# Altium schematic sheet Main.SchDoc
size A3; Organization: CZ-GZZ; Address1: PO BOX 37; Address2: Mt Colah; Address3: NSW; Address4: Australia 2079; SheetNumber: 1; SheetTotal: 1
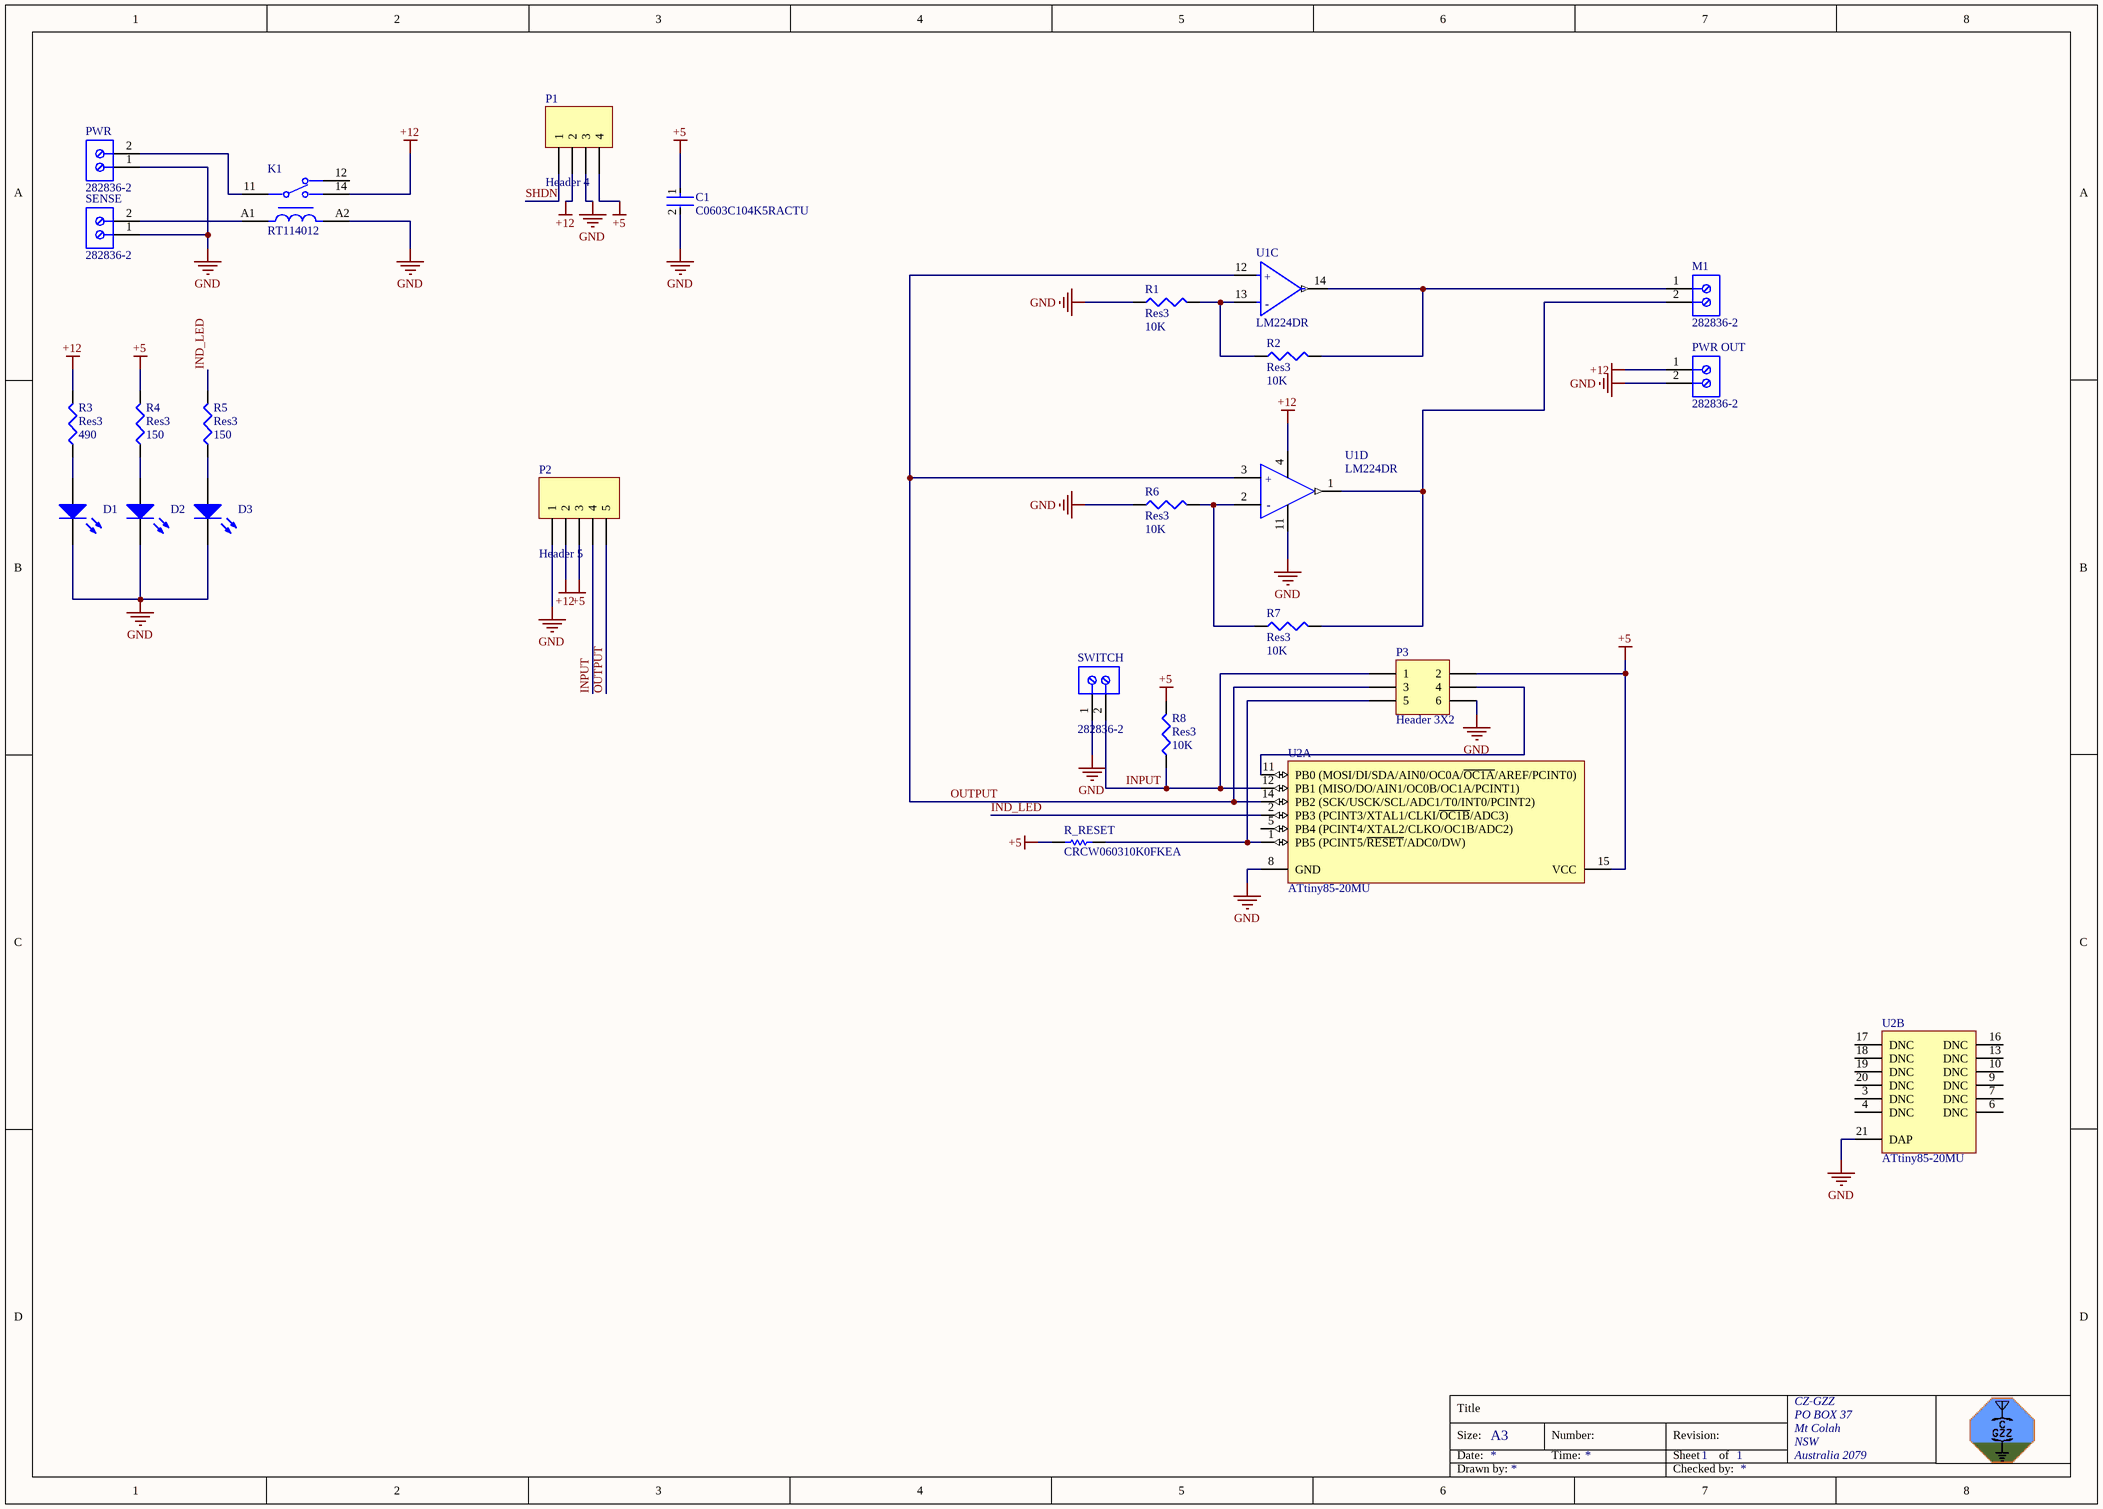
[diagram p0: Main.SchDoc]

## Parts
C1  C0603C104K5RACTU  [FP-C0603C-CF-MFG]
D1  LED2  [3.2X1.6X1.1]  (value not drawn)
D2  LED2  [3.2X1.6X1.1]  (value not drawn)
D3  LED2  [3.2X1.6X1.1]  (value not drawn)
K1  RT114012  [FP-RT114012-MFG]
M1  282836-2  [TECO-282836-2_V]
P1  Header 4  [HDR1X4]
P2  Header 5  [HDR1X5]
P3  Header 3X2  [HDR2X3]
PWR  282836-2  [TECO-282836-2_V]
PWR_OUT  282836-2  [TECO-282836-2_V]
R1  Res3  value 10K  [J1-0603]
R2  Res3  value 10K  [J1-0603]
R3  Res3  value 490  [J1-0603]
R4  Res3  value 150  [J1-0603]
R5  Res3  value 150  [J1-0603]
R6  Res3  value 10K  [J1-0603]
R7  Res3  value 10K  [J1-0603]
R8  Res3  value 10K  [J1-0603]
R_RESET  CRCW060310K0FKEA  [RESC1609X50X30NL8T20]
SENSE  282836-2  [TECO-282836-2_V]
SWITCH  282836-2  [TECO-282836-2_V]
U1  LM224DR  [FP-D0014A-IPC_C]  (parts C,D of 4)
U2  ATtiny85-20MU  [20M1_N]  (parts A,B of 2)

## Nets
+5: C1.1 P1.4 P2.3 P3.2 R4.2 R8.2 R_RESET.2 U2.15(VCC)
+12: K1.14 P1.2 P2.2 PWR_OUT.1 R3.2 U1.4(VCC)
GND: C1.2 D1.2(K) D2.2(K) D3.2(K) K1.A2 P1.3 P2.1 P3.6 PWR.1 PWR_OUT.2 R1.1 R6.1 SENSE.1 SWITCH.1 U1.11(GND) U2.8(GND) U2.21(DAP)
IND_LED: R5.2 U2.2(PB3_(PCINT3/XTAL1/CLKI/~{OC1B}/ADC3))
INPUT: P2.4 P3.1 R8.1 SWITCH.2 U2.12(PB1_(MISO/DO/AIN1/OC0B/OC1A/PCINT1))
OUTPUT: P2.5 P3.3 U1.3(1IN+) U1.12(4IN+) U2.14(PB2_(SCK/USCK/SCL/ADC1/T0/INT0/PCINT2))
SHDN: P1.1
NetD1_1: D1.1(A) R3.1
NetD2_1: D2.1(A) R4.1
NetD3_1: D3.1(A) R5.1
NetK1_11: K1.11 PWR.2
NetK1_A1: K1.A1 SENSE.2
NetM1_1: M1.1 R2.2 U1.14(4OUT)
NetM1_2: M1.2 R7.2 U1.1(1OUT)
NetP3_4: P3.4 U2.11(PB0_(MOSI/DI/SDA/AIN0/OC0A/~{OC1A}/AREF/PCINT0))
NetP3_5: P3.5 R_RESET.1 U2.1(PB5_(PCINT5/~{RESET}/ADC0/DW))
NetR1_2: R1.2 R2.1 U1.13(4IN-)
NetR6_2: R6.2 R7.1 U1.2(1IN-)

Not connected (* = marked no-connect by the designer): K1 12; U2 3(DNC) 4(DNC) 5(PB4_(PCINT4/XTAL2/CLKO/OC1B/ADC2)) 6(DNC) 7(DNC) 9(DNC) 10(DNC) 13(DNC) 16(DNC) 17(DNC) 18(DNC) 19(DNC) 20(DNC)

## Notes on the sheet
- Title
- Size:
- Date:
- A3
- Number:
- Time:
- Revision:
- Sheet
- of
- Drawn by:
- Checked by:
- (in symbol CMP-04895-000142-1, part C) +
- (in symbol CMP-04895-000142-1, part D) +

## Library data of the parts
C1 = CMP-2006-03061-2: CAP CER 0.1UF 50V X7R 0603; Manufacturer: KEMET; Tolerance: 0.1; Temperature Coefficient: 30ppm/°C; Material: Ceramic; Automotive Grade: Grade 1; Value: 0.10 μF; Temperature: -55°C to +125°C; RoHS: TRUE; Temperature Range High: +125°C; Lead Free: Yes; Octopart: https://octopart.com/c0603c104k5ractu-kemet-139244; Digikey Description: CAP CER 0.1UF 50V X7R 0603; Category: Cap; Package: C0603C-CF; ComponentLink2Description: Datasheet; Temperature Range Low: -55°C; Device Class L1: Passive Components; Voltage Rating: 50 V; Automotive: Yes; Device Class L3: Ceramic Capacitors; ComponentLink2URL: https://api.kemet.com/component-edge/download/datasheet/C0603C100J5GACAUTO.pdf; Capacitance: 0.10 μF; Device Class L2: Capacitors; Manufacturer Part Number: C0603C104K5RACTU; Temperature Characteristic: X7R; Height: 0.87mm
D1-D3 = LED2: Typical RED, GREEN, YELLOW, AMBER GaAs LED; Published: 8-Jun-2000; LatestRevisionDate: 17-Jul-2002; LatestRevisionNote: Re-released for DXP Platform.; PackageVersion: Feb-2002; PackageReference: 3.2X1.6X1.1; Publisher: Altium Limited; PackageDescription: SM LED; 2 Flat Leads
K1 = CMP-03395-000068-1: RELAY GEN PURPOSE SPDT 12A 12V; Manufacturer: TE Connectivity; Coil Power: 400mW; Coil Resistance: 360Ω; Coil Type: Non-Latching; Number Of Contacts: 1; Height: 15.7mm; Throw Configuration: SPDT; Mouser Description: General Purpose Relays RT114012; Device Class L1: Electromechanical; ComponentLink2URL: https://www.te.com/commerce/DocumentDelivery/DDEController?Action=showdoc&DocId=Data+Sheet%7FRT1%7F0219%7Fpdf%7FEnglish%7FENG_DS_RT1_0219.pdf%7F1419108-1; Digikey Description: RELAY GEN PURPOSE SPDT 12A 12V; Package: RT114012; RoHS: TRUE; ComponentLink2Description: Datasheet; Octopart: https://octopart.com/rt114012-te+connectivity-39636422; Device Class L2: Relays; Manufacturer Part Number: RT114012; Ambient Temperature Range High: +85°C; Ambient Temperature Range Low: -40°C; Coil Voltage: 12V; Current Rating: 12A; Category: Relay; Lead Free: Yes; Device Class L3: Power Relays; Automotive: No
M1 PWR PWR_OUT SENSE SWITCH = CMP-1684-00017-1: Female Header, Pitch 5 mm, 1 x 2 Position, Height 10 mm, Tail Length 3.5 mm, Rohs, Bulk; Manufacturer: TE Connectivity; Wire Gauge: 16-30AWG; Product Training Modules: Wire-to-BoardEurostyleTerminalBlocks; Clamp Material - Plating: Brass-NickelPlated; Voltage: 300V; Mating Orientation: HorizontalwithBoard; Current: 13.5A; Pitch: 0.197"(5.00mm); Screw Thread: M3; 3D Model: 282836-2.pdf; Other Names: 5ULV-02B / A98076; Dynamic Catalog: BuchananSeries; Number of Levels: 1; Torque - Screw: 0.68Nm(6Lb-In); Featured Product: EurostyleTerminalBlockConnectors; Positions Per Level: 2; Wire Termination: Screw-RisingCageClamp; Datasheet URL: http://www.te.com.cn/commerce/DocumentDelivery/DDEController?Action=showdoc&DocId=Catalog+Section%7F1308389_EUROSTYLE_TERMINAL_BLOCKS%7F0607%7Fpdf%7FEnglish%7FENG_CS_1308389_EUROSTYLE_TERMINAL_BLOCKS_0607.pdf%7F282836-2; Color: Green; Family: TerminalBlocks-WiretoBoard; RoHS Information: 282836-2StatementofCompliance; Standard Package: 300; Contact Material - Plating: Brass-TinPlated; Manufacturer URL: http://www.te.com; Housing Material: Polyamide(PA66),Nylon6/6; Features: Interlocking(Side); Package Description: Female Header, Pitch 5 mm, 1 x 2 Position, Height 10 mm, Tail Length 3.5 mm; Mounting Type: ThroughHole; Package Reference: THD; Packaging: Bulk; Series: Buchanan; Category: Connectors,Interconnects; Screw Material - Plating: Brass-NickelPlated
P1 = Header 4: Header, 4-Pin; LatestRevisionDate: 17-Jul-2002; LatestRevisionNote: Re-released for DXP Platform.; Publisher: Altium Limited
P2 = Header 5: Header, 5-Pin; LatestRevisionDate: 17-Jul-2002; LatestRevisionNote: Re-released for DXP Platform.; Publisher: Altium Limited
P3 = Header 3X2: Header, 3-Pin, Dual row; LatestRevisionDate: 17-Jul-2002; LatestRevisionNote: Re-released for DXP Platform.; Publisher: Altium Limited
R1-R8 = Res3: Resistor; Published: 8-Jun-2000; LatestRevisionDate: 29-May-2009; LatestRevisionNote: IPC-7351 Footprint Added.; PackageReference: J1-0603; Publisher: Altium Limited; PackageDescription: Chip Resistor
R_RESET = CMP-1666-00005-4: Chip Resistor, 10 KOhm, +/- 1%, 100 mW, -55 to 155 degC, 0603 (1608 Metric), RoHS, Tape and Reel; Manufacturer: Vishay Semiconductor; Voltage Rating: 75 V; Max Operating Temperature: 155 degC; PackageDescription: 2-Pin Surface Mount Device, Body 1.575 x 0.85 mm; ComponentLink1Description: Manufacturer URL; RoHSCompliant: true; PackageReference: 0603; REACH SVHC: Unknown; Length: 1.55 mm; DatasheetVersion: 06/2012; Packaging: Tape and Reel; Min Operating Temperature: -55 degC; Mounting Technology: Surface Mount; ComponentLink2URL: https://datasheet.ciiva.com/11809/0900766b80d98afc-11809037.pdf; Height: 0.45 mm; ComponentLink2Description: Datasheet; Package Quantity: 5000; ComponentLink1URL: http://www.vishay.com/
U1 = CMP-04895-000142-1: IC OPAMP GP 4 CIRCUIT 14SOIC; Input Offset Voltage (Vos): 5mV; Power Supply Rejection Ratio (PSRR): 65dB; Max Supply Voltage: 32V; Min Dual Supply Voltage: 1.5V; Max Dual Supply Voltage: 16V; Operating Supply Current: 1.4mA; Slew Rate: 0.5V/µs; Max Power Dissipation: 1.26W; Unity Gain Bandwidth Product: 1.2MHz; Number of Elements: 4; Input Bias Current: 150nA; Nominal Supply Current: 10mA; Output Current per Channel: 60mA; Voltage Gain: 100dB; Common Mode Rejection Ratio: 70dB; Min Supply Voltage: 3V; Amplifier Type: GENERAL PURPOSE; Dual Supply Voltage: 9V; Output Current: 30mA; Length: 8.65mm; Height: 1.58mm; Series: -; Technology: BIPOLAR; Package Quantity: 1; Lead Free: Lead Free; Number of Pins: 14; Operating Supply Voltage: 16V; Min Operating Temperature: -25°C; Radiation Hardening: No; Case/Package: SOIC; Gain Bandwidth Product: 1.2MHz; Max Operating Temperature: 85°C; Bandwidth: 1.2MHz; Packaging: Tape and Reel; RoHS Compliant: Yes; Supply Current: 10mA; Contact Plating: Gold; Width: 3.91mm; Number of Channels: 4; Number of Circuits: 4; Number of Amplifiers: 4; REACH SVHC: No SVHC; Mount: Surface Mount
U2 = CMP-0093-00110-2: 8-bit AVR Microcontroller, 20MHz, 2.7-5.5V, 8K Flash, 512 Bytes EEPROM, 512 Bytes SRAM, Industrial Grade (-40°C to 85°C), 20-pad MLF, Pb-Free; Code_JEDEC: MO-220WGGD-5; ComponentLink1Description: Manufacturer URL; ComponentLink3Description: ATtiny25/45/85 Summary; ComponentLink1URL: http://www.atmel.com/; ComponentLink2Description: ATtiny25/45/85 Datasheet; PackageVersion: revA, Oct-2004; DatasheetVersion: revN, Apr-2011; ComponentLink3URL: http://www.atmel.com/dyn/resources/prod_documents/2586S.pdf; PackageReference: 20M1; RevisionNote: DatasheetVersion updated. URLs added.; ComponentLink2URL: http://www.atmel.com/dyn/resources/prod_documents/doc2586.pdf; PackageDescription: 20-pad, 4 x 4 x 0.8 mm Body, Lead Pitch 0.50 mm, 2.6 mm Exposed Pad, Micro Lead Frame Package (MLF)